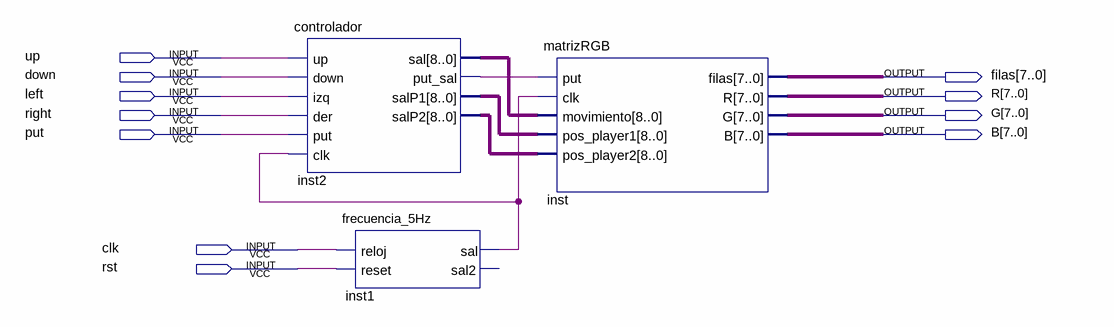
[diagram p0: schematic sheet]
// Quartus schematic matriz.bdf as structural Verilog: 3 symbols, 11 pins
module matriz (
  input  up,
  input  down,
  input  left,
  input  right,
  input  put,
  input  clk,
  input  rst,
  output [7:0] filas,
  output [7:0] R,
  output [7:0] G,
  output [7:0] B
);

  wire inst1_sal, inst2_put_sal;
  wire [8:0] inst2_sal, inst2_salp1, inst2_salp2;

  controlador inst2 (
    .up(up), .down(down), .izq(left), .der(right), .put(put), .clk(inst1_sal), .sal(inst2_sal),
    .put_sal(inst2_put_sal), .salP1(inst2_salp1), .salP2(inst2_salp2));
  frecuencia_5Hz inst1 (.reloj(clk), .reset(rst), .sal(inst1_sal));  // open: sal2
  matrizRGB inst (
    .put(inst2_put_sal), .clk(inst1_sal), .movimiento(inst2_sal), .pos_player1(inst2_salp1),
    .pos_player2(inst2_salp2), .filas(filas), .R(R), .G(G), .B(B));
endmodule
